# Altium project lora-concentrator-868.PrjPcb
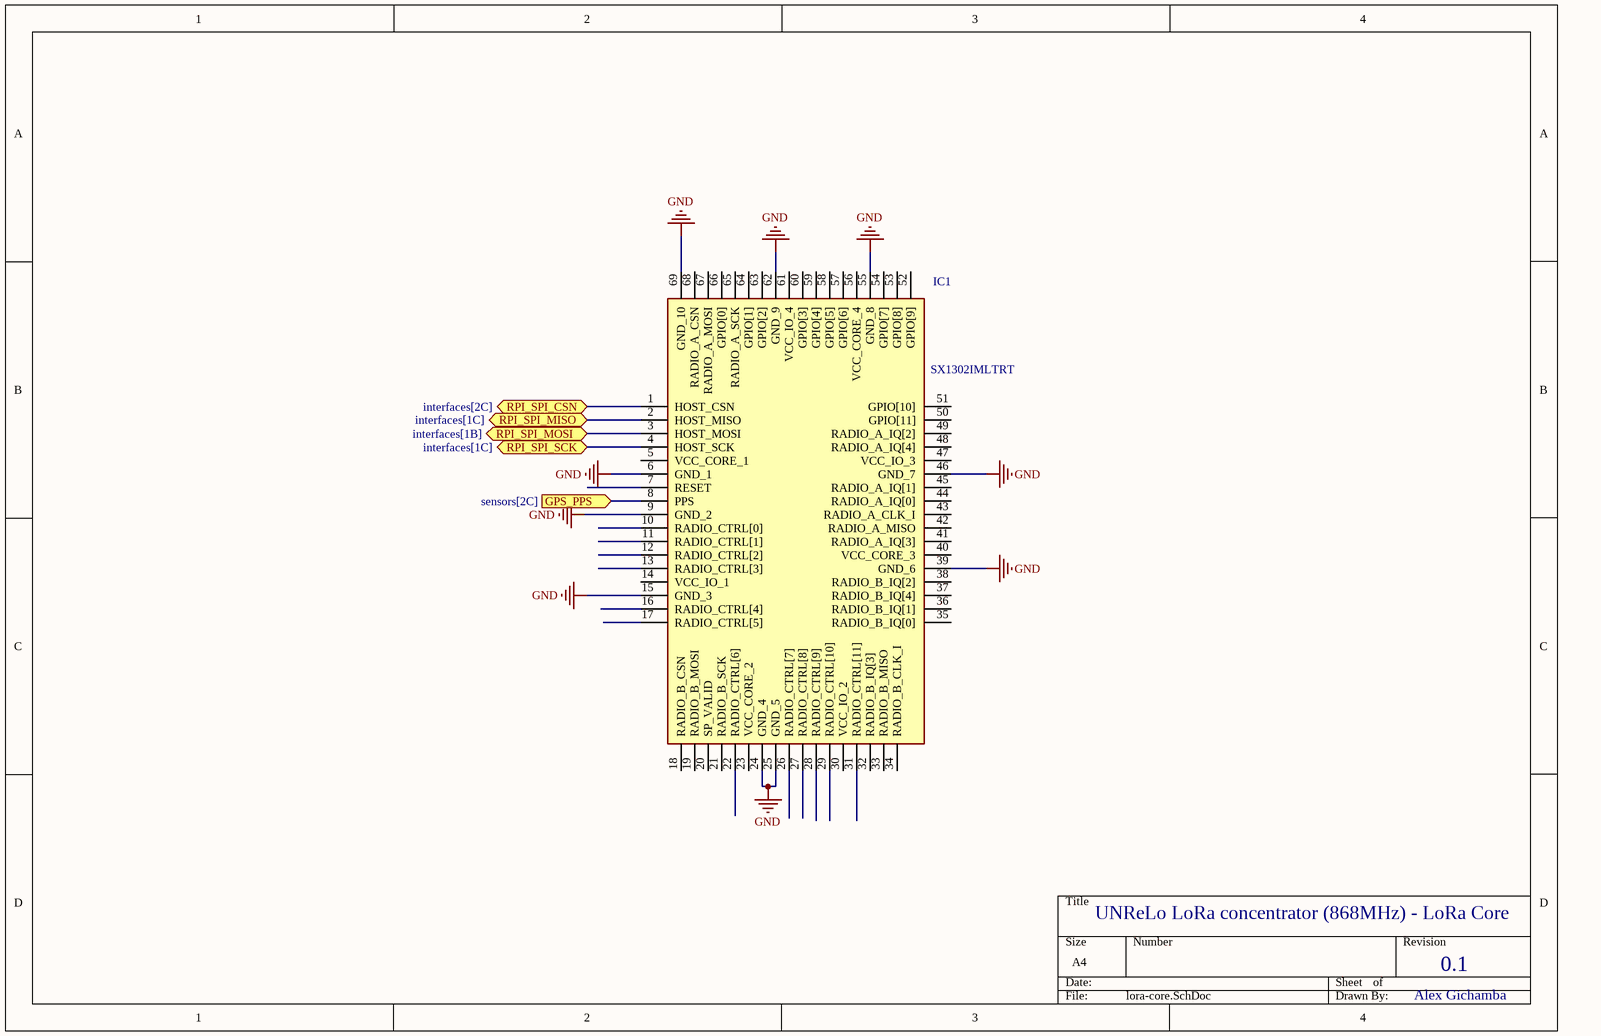
[diagram p0: lora-core.SchDoc]
4 sheets, 8 parts. Net scope: flat (ports and power ports of the same name join across sheets).
Board file: concentrator_pcb.PcbDoc
Sheets:
  lora-core.SchDoc
  interfaces.SchDoc
  sensors.SchDoc
  power.SchDoc

## Sheet lora-core.SchDoc
size A4; SheetNumber: 1; SheetTotal: 5

### Parts
IC1  SX1302IMLTRT  [QFN35P700X700X80-69N-D]

### Ports
GPS_PPS (in, see sensors[2C]), RPI_SPI_CSN (bidir, see interfaces[2C]), RPI_SPI_MISO (bidir, see interfaces[1C]), RPI_SPI_MOSI (bidir, see interfaces[1B]), RPI_SPI_SCK (bidir, see interfaces[1C])

### Nets
GND: IC1.6(GND_1) IC1.9(GND_2) IC1.15(GND_3) IC1.24(GND_4) IC1.25(GND_5) IC1.39(GND_6) IC1.46(GND_7) IC1.55(GND_8) IC1.62(GND_9) IC1.69(GND_10)
NetIC1_1: IC1.1(HOST_CSN) ; port RPI_SPI_CSN
NetIC1_2: IC1.2(HOST_MISO) ; port RPI_SPI_MISO
NetIC1_3: IC1.3(HOST_MOSI) ; port RPI_SPI_MOSI
NetIC1_4: IC1.4(HOST_SCK) ; port RPI_SPI_SCK
NetIC1_8: IC1.8(PPS) ; port GPS_PPS

Not connected (* = marked no-connect by the designer): IC1 5(VCC_CORE_1) 7(RESET) 10(RADIO_CTRL[0]) 11(RADIO_CTRL[1]) 12(RADIO_CTRL[2]) 13(RADIO_CTRL[3]) 14(VCC_IO_1) 16(RADIO_CTRL[4]) 17(RADIO_CTRL[5]) 18(RADIO_B_CSN) 19(RADIO_B_MOSI) 20(SP_VALID) 21(RADIO_B_SCK) 22(RADIO_CTRL[6]) 23(VCC_CORE_2) 26(RADIO_CTRL[7]) 27(RADIO_CTRL[8]) 28(RADIO_CTRL[9]) 29(RADIO_CTRL[10]) 30(VCC_IO_2) 31(RADIO_CTRL[11]) 32(RADIO_B_IQ[3]) 33(RADIO_B_MISO) 34(RADIO_B_CLK_I) 35(RADIO_B_IQ[0]) 36(RADIO_B_IQ[1]) 37(RADIO_B_IQ[4]) 38(RADIO_B_IQ[2]) 40(VCC_CORE_3) 41(RADIO_A_IQ[3]) 42(RADIO_A_MISO) 43(RADIO_A_CLK_I) 44(RADIO_A_IQ[0]) 45(RADIO_A_IQ[1]) 47(VCC_IO_3) 48(RADIO_A_IQ[4]) 49(RADIO_A_IQ[2]) 50(GPIO[11]) 51(GPIO[10]) 52(GPIO[9]) 53(GPIO[8]) 54(GPIO[7]) 56(VCC_CORE_4) 57(GPIO[6]) 58(GPIO[5]) 59(GPIO[4]) 60(GPIO[3]) 61(VCC_IO_4) 63(GPIO[2]) 64(GPIO[1]) 65(RADIO_A_SCK) 66(GPIO[0]) 67(RADIO_A_MOSI) 68(RADIO_A_CSN)

### Notes on the sheet
- UNReLo LoRa concentrator (868MHz) - LoRa Core
- 0.1
- Alex Gichamba

### Library data of the parts
IC1 = SX1302IMLTRT: Integrated Circuit; Manufacturer_Name: SEMTECH; Datasheet Link: https://datasheet.datasheetarchive.com/originals/distributors/Datasheets_SAMA/c18cc298abe30af156b2783e16147acc.pdf; Height: 0.8mm; Manufacturer_Part_Number: SX1302IMLTRT; Mouser Part Number: 947-SX1302IMLTRT; Mouser Price/Stock: https://www.mouser.co.uk/ProductDetail/Semtech/SX1302IMLTRT?qs=bZr6mbWTK5nALa%252B96PTK0Q%3D%3D

## Sheet interfaces.SchDoc
size A4; SheetNumber: 2; SheetTotal: 5
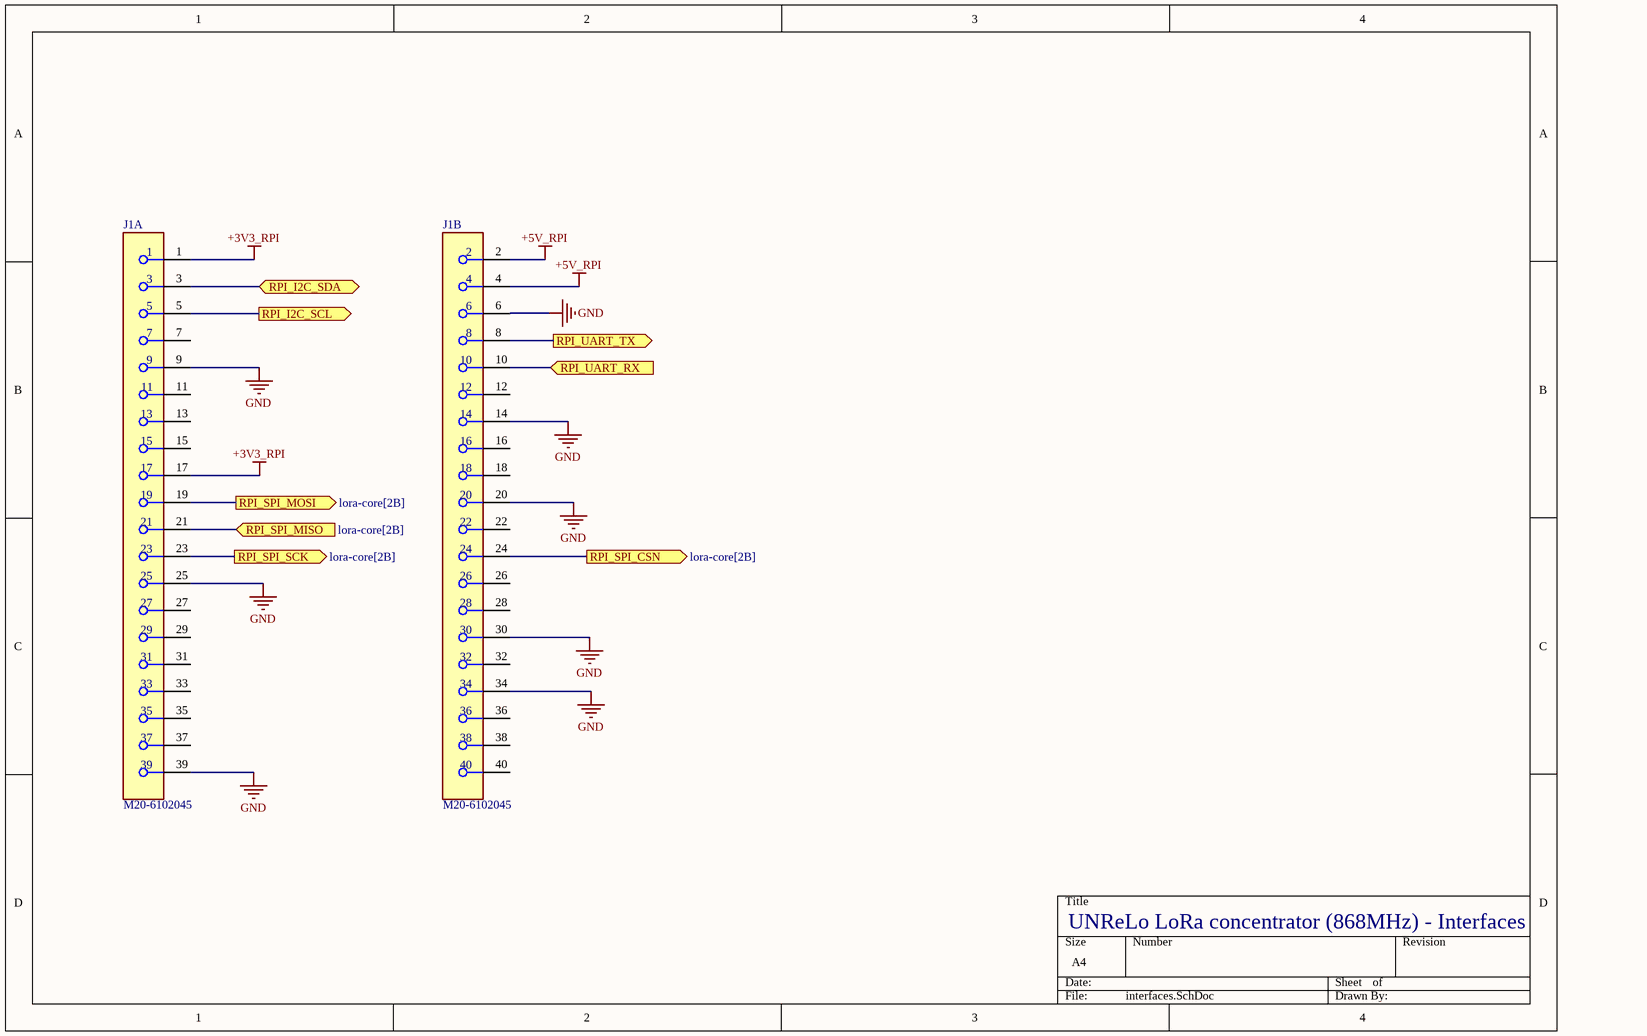
[diagram p1: interfaces.SchDoc]

### Parts
J1  M20-6102045  [FP-M20-6102045-MFG]  (parts A,B of 2)

### Ports
RPI_I2C_SCL (out), RPI_I2C_SDA (bidir), RPI_SPI_CSN (out, see lora-core[2B]), RPI_SPI_MISO (in, see lora-core[2B]), RPI_SPI_MOSI (out, see lora-core[2B]), RPI_SPI_SCK (out, see lora-core[2B]), RPI_UART_RX (in), RPI_UART_TX (out)

### Nets
+3V3_RPI: J1.1 J1.17
+5V_RPI: J1.2 J1.4
GND: J1.6 J1.9 J1.14 J1.20 J1.25 J1.30 J1.34 J1.39
NetIC1_1: J1.24 ; port RPI_SPI_CSN
NetIC1_2: J1.21 ; port RPI_SPI_MISO
NetIC1_3: J1.19 ; port RPI_SPI_MOSI
NetIC1_4: J1.23 ; port RPI_SPI_SCK
NetJ1_3: J1.3 ; port RPI_I2C_SDA
NetJ1_5: J1.5 ; port RPI_I2C_SCL
NetJ1_8: J1.8 ; port RPI_UART_TX
NetJ1_10: J1.10 ; port RPI_UART_RX

Not connected (* = marked no-connect by the designer): J1 7 11 12 13 15 16 18 22 26 27 28 29 31 32 33 35 36 37 38 40

### Notes on the sheet
- UNReLo LoRa concentrator (868MHz) - Interfaces

### Library data of the parts
J1 = CMP-15831-000080-1: CONN STKTHRU PC/104 40POS PCB; Current Rating: 3A; Pitch: 2.54mm; Insulation Resistance: 5GR; Contact Resistance: 30mR; Number of Positions: 40; Gender: Receptacle; REACH SVHC: No SVHC; Housing Material: Nylon; Number of Rows: 2; Min Operating Temperature: -55°C; Contact Plating: Gold; Orientation: Straight; Mount: Through Hole; Contact Material: Bronze; Length: 51.46mm; Weight: 0.218205oz; Number of Contacts: 40; Packaging: Rail/Tube; Depth: 5.25mm; Termination: Solder; Radiation Hardening: No; Flammability Rating: UL94 V-0; Housing Color: Black; Max Operating Temperature: 105°C; Material: Nylon; Package Quantity: 11; Color: Black; Max Current Rating: 3A; Series: M20

## Sheet sensors.SchDoc
size A4; SheetNumber: 3; SheetTotal: 3
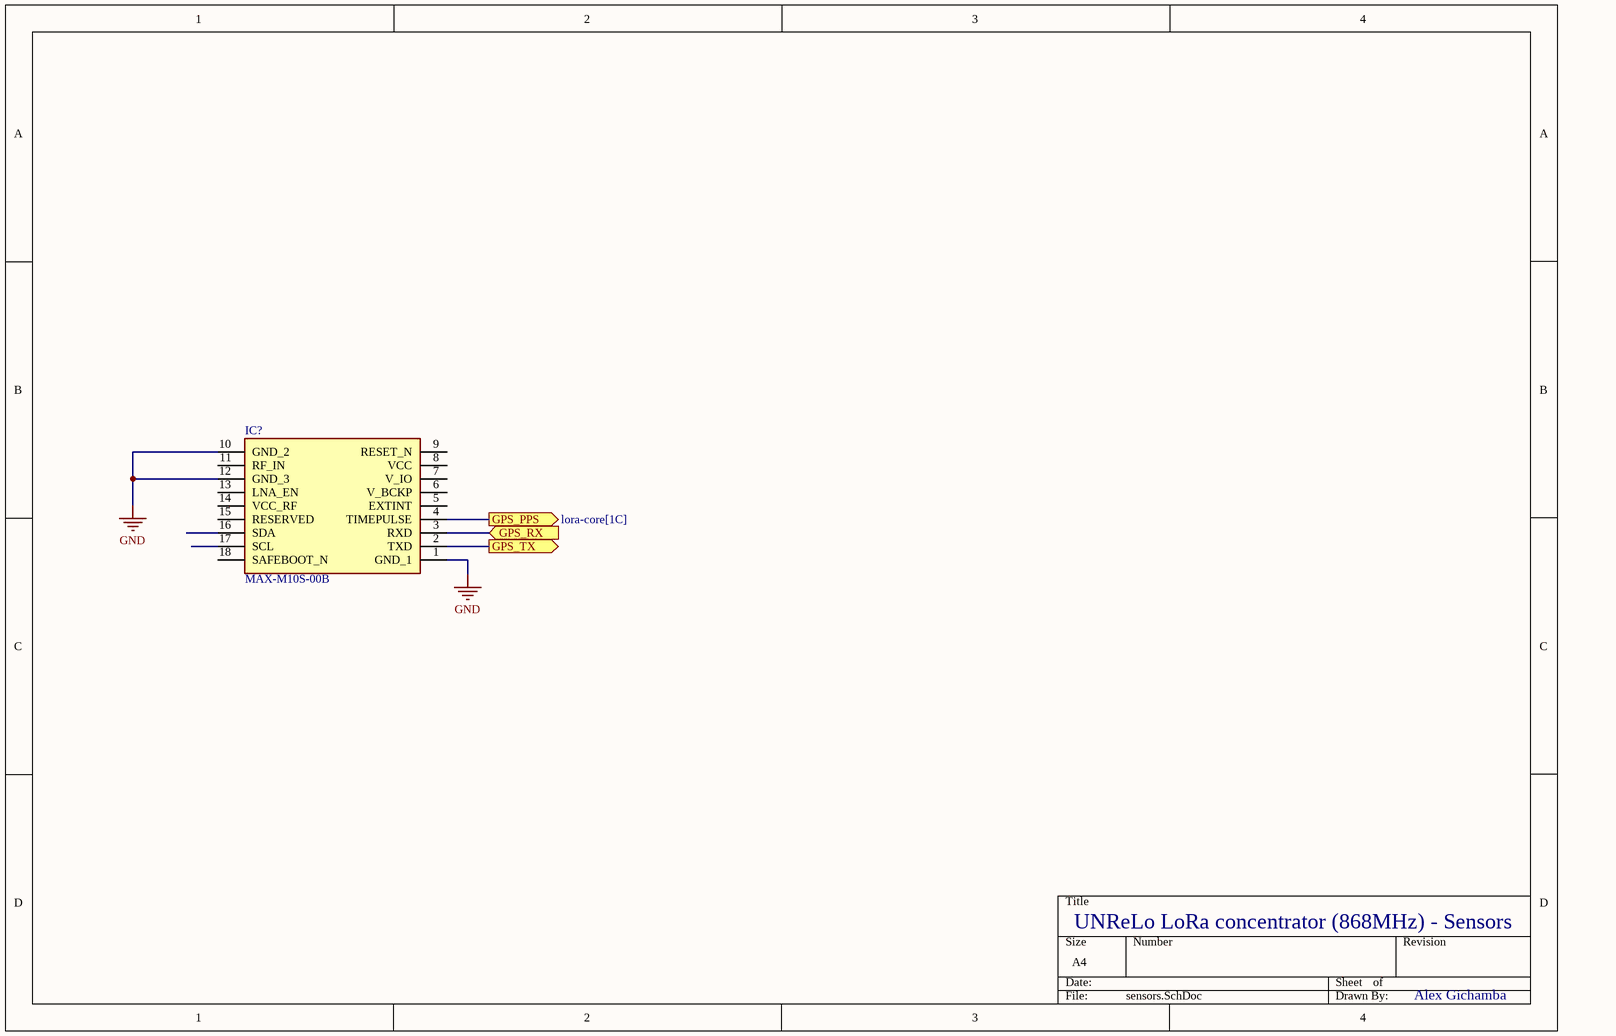
[diagram p2: sensors.SchDoc]

### Parts
IC?  MAX-M10S-00B  [MAXM10S00B]

### Ports
GPS_PPS (out, see lora-core[1C]), GPS_RX (in), GPS_TX (out)

### Nets
GND: IC?.1(GND_1) IC?.10(GND_2) IC?.12(GND_3)
NetIC1_8: IC?.4(TIMEPULSE) ; port GPS_PPS
NetIC?_2: IC?.2(TXD) ; port GPS_TX
NetIC?_3: IC?.3(RXD) ; port GPS_RX

Not connected (* = marked no-connect by the designer): IC? 5(EXTINT) 6(V_BCKP) 7(V_IO) 8(VCC) 9(RESET_N) 11(RF_IN) 13(LNA_EN) 14(VCC_RF) 15(RESERVED) 16(SDA) 17(SCL) 18(SAFEBOOT_N)

### Notes on the sheet
- UNReLo LoRa concentrator (868MHz) - Sensors
- Alex Gichamba

### Library data of the parts
IC? = MAX-M10S-00B: Integrated Circuit; Manufacturer_Name: U-Blox; Datasheet Link: https://content.u-blox.com/sites/default/files/MAX-M10S_IntegrationManual_UBX-20053088.pdf; Height: 2.7mm; Manufacturer_Part_Number: MAX-M10S-00B; Mouser Part Number: 377-MAX-M10S-00B; Mouser Price/Stock: https://www.mouser.co.uk/ProductDetail/u-blox/MAX-M10S-00B?qs=A6eO%252BMLsxmT0PfQYPb7LLQ%3D%3D

## Sheet power.SchDoc
size A4; SheetNumber: 5; SheetTotal: 5
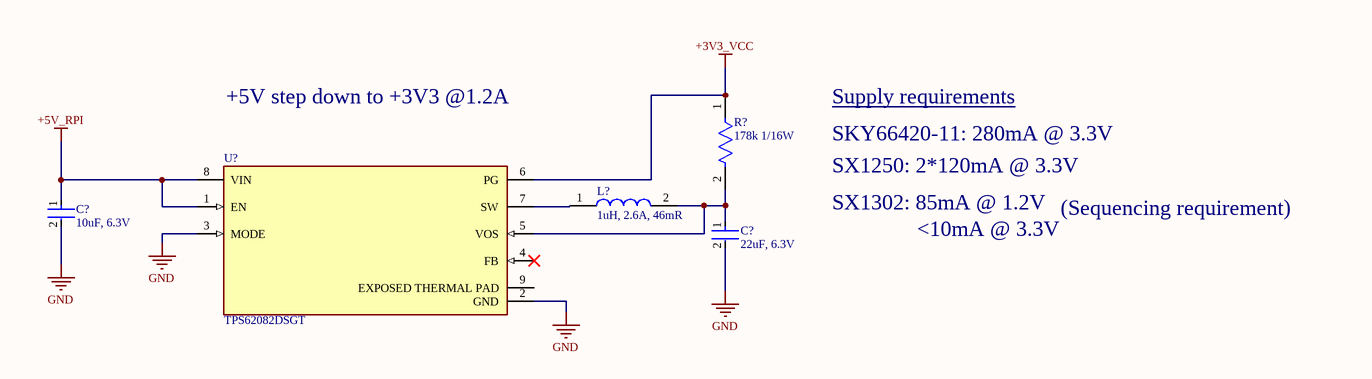
[diagram p3: power.SchDoc]

### Parts
(Parts that share a designator on the sheet are numbered #1, #2 ... from top to bottom, then left to right.)
C?#1  10uF, 6.3V  [FP-CL10-IPC_A]
C?#2  22uF, 6.3V  [FP-GRM21B-0_15-IPC_B]
L?  1uH, 2.6A, 46mR  [XFL3012102MEC]
R?  178k 1/16W  [FP-RN731J-MFG]
U?  TPS62082DSGT  [FP-DSG0008A-IPC_C]

### Nets
+3V3_VCC: R?.1 U?.6(PG)
+5V_RPI: C?#1.1 U?.1(EN) U?.8(VIN)
GND: C?#1.2 C?#2.2 U?.2(GND) U?.3(MODE)
NetC?#2_1: C?#2.1 L?.2 R?.2 U?.5(VOS)
NetL?_1: L?.1 U?.7(SW)

Not connected (* = marked no-connect by the designer): U? 4(FB)* 9(EXPOSED_THERMAL_PAD)

### Notes on the sheet
- +5V step down to +3V3 @1.2A
- Supply requirements
- SKY66420-11: 280mA @ 3.3V
- SX1250: 2*120mA @ 3.3V
- SX1302: 85mA @ 1.2V
- <10mA @ 3.3V
- (Sequencing requirement)

### Library data of the parts
C?#1 = CMP-13271-001938-1: Cap Ceramic 10uF 6.3V X5R ±20% Pad SMD 0603 +85°C T/R; Contact Plating: Tin; Height: 0.8mm; Width: 0.031inch; Min Operating Temperature: -55°C; Capacitance: 10uF; Dielectric: X5R; Voltage Rating: 6.3V; Case/Package: 0603; Package Quantity: 1; Radiation Hardening: No; Packaging: Tape and Reel; Max Operating Temperature: 85°C; Voltage: 6.3V; Thickness: 0.035inch; Mount: Surface Mount; Case Code (Imperial): 0603; Case Code (Metric): 1608; Depth: 0.8mm; Tolerance: 20%; Length: 1.6mm
C?#2 = CMP-2007-03385-2: Chip Multilayer Ceramic Capacitors for General Purpose, 0805, 22uF, X5R, 15%, 20%, 6.3V; Material: Ceramic; Max Operating Temperature: 85°C; Voltage: 6.3V; Min Operating Temperature: -55°C; Case/Package: 0805; Thickness: 0.053inch; Dielectric: X5R; Packaging: Tape and Reel; Depth: 1.25mm; Termination: SMD/SMT; Voltage Rating (DC): 6.3V; Radiation Hardening: No; Tolerance: 20%; Mount: Surface Mount; Lead Free: Lead Free; Package Quantity: 1; REACH SVHC: No SVHC; Voltage Rating: 6.3V; Capacitance: 22uF; Length: 2mm; Case Code (Imperial): 0805; Case Code (Metric): 2012; Width: 0.049inch; Height: 1.25mm
L? = XFL3012-102MEC: Inductor; Manufacturer_Name: COILCRAFT; Datasheet Link: https://www.coilcraft.com/getmedia/f76a3c9b-4fff-4397-8028-ef8e043eb200/xfl3012.pdf; Height: 1.3mm; Manufacturer_Part_Number: XFL3012-102MEC; Mouser Part Number: 994-XFL3012-102MEC; Mouser Price/Stock: https://www.mouser.co.uk/ProductDetail/Coilcraft/XFL3012-102MEC?qs=zCSbvcPd3pbDTGh%2Fo89qrw%3D%3D
R? = CMP-03211-009852-1: Thin Film Resistors RN 0603 178KΩ 0.1% 10ppm/°C; Manufacturer: TE Connectivity; Manufacturer Part Number: RN73C1J178KBTDF; Voltage Rating: 50V; Power Rating: 0.063W; Device Class L3: Chip SMD Resistors; octopart_url: https://octopart.com/rn73c1j178kbtdf-te+connectivity-22738583; Ipc Land Pattern Name: RESC15580X45; Device Class L1: Passive Components; Height: 0.55mm; Octopart: https://octopart.com/rn73c1j178kbtdf-te+connectivity-22738583; Automotive: No; Temperature Range Low: -55°C; Temperature: -55°C to +155°C; Value: 178KΩ; Composition: Thin Film; Temperature Range High: +155°C; Device Class L2: Resistors; ComponentLink2Description: Datasheet; Series: RN73; packaging: 1000 Reel; Resistance: 178KΩ; Tolerance: 0.1%; Category: Res; Package: RN731J; Lead Free: Yes; RoHS: TRUE; Temperature Coefficient: 10ppm/°C; ComponentLink2URL: https://www.te.com/commerce/DocumentDelivery/DDEController?Action=showdoc&DocId=Data+Sheet%7F1773270%7FP%7Fpdf%7FEnglish%7FENG_DS_1773270_P.pdf%7F9-1614352-9
U? = CMP-0323-00342-4: IC REG BUCK 3.3V 1.2A 8WSON; Max Input Voltage: 6V; Min Input Voltage: 2.3V; Output Type: Fixed; Switching Frequency: 2MHz; Quiescent Current: 6uA; Number of Outputs: 1; Synchronous Rectifier: Yes; Contact Plating: Gold; Packaging: Tape and Reel; Radiation Hardening: No; Package Quantity: 1; Length: 2.1mm; Height: 0.75mm; Max Output Current: 1.2A; Number of Pins: 8; Output Current: 1.2A; Lead Free: Lead Free; Min Operating Temperature: -40°C; Max Operating Temperature: 125°C; REACH SVHC: No SVHC; Output Voltage: 3.3V; Min Output Voltage: 3.3V; Width: 2.1mm; Nominal Output Voltage: 3.3V; Max Output Voltage: 3.3V; Operating Supply Voltage: 6V

## Nets that join several sheets
+5V_RPI: interfaces (J1.2 J1.4), power (C?#1.1 U?.1 U?.8)
GND: lora-core (10 pins), interfaces (8 pins), sensors (IC?.1 IC?.10 IC?.12), power (C?#1.2 C?#2.2 U?.2 U?.3)
NetIC1_1: lora-core (IC1.1), interfaces (J1.24)
NetIC1_2: lora-core (IC1.2), interfaces (J1.21)
NetIC1_3: lora-core (IC1.3), interfaces (J1.19)
NetIC1_4: lora-core (IC1.4), interfaces (J1.23)
NetIC1_8: lora-core (IC1.8), sensors (IC?.4)